# EAGLE design untitled (EAGLE 6.5.0)
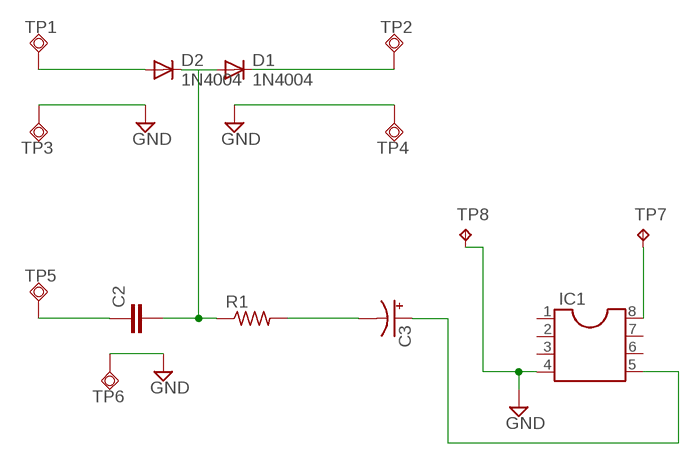
[diagram p0: schematic, sheet 1]

## Parts
C2  C5/3  [C5B3]
C3  CPOL-USE5-6  [E5-6]
D1  1N4004  [DO41-10]
D2  1N4004  [DO41-10]
IC1  DIL8S  [SOCKET-08]
R1  R-US_0204/7  [0204/7]
TP1  TPSQPAD1-20Y  [P1-20Y]
TP2  TPSQPAD1-20Y  [P1-20Y]
TP3  TPSQPAD1-20Y  [P1-20Y]
TP4  TPSQPAD1-20Y  [P1-20Y]
TP5  TPSQPAD1-20Y  [P1-20Y]
TP6  TPSQPAD1-20Y  [P1-20Y]
TP7  TPPAD1-20  [P1-20]
TP8  TPPAD1-20Y  [P1-20Y]

## Nets
GND: IC1.4 TP3.TP TP4.TP TP6.TP TP8.TP
N$1: C3.- R1.2
N$2: C2.2 D1.A D2.C R1.1
N$3: C3.+ IC1.5
N$4: C2.1 TP5.TP
N$5: IC1.8 TP7.TP
N$8: D2.A TP1.TP
N$9: D1.C TP2.TP
Unconnected: IC1.1 IC1.2 IC1.3 IC1.6 IC1.7

## Library data of the parts
C2 = capacitor-wima:C: CAPACITOR naming: grid - package width
C3 = rcl:CPOL-US: POLARIZED CAPACITOR, American symbol
D1 = diode:1N4004: DIODE
D2 = adafruit:1N4004: DIODE
IC1 = ic-package:DIL8: Dual In Line / Socket
R1 = rcl:R-US_: RESISTOR, American symbol
TP1-TP6 = testpad:TPSQ: Test pad
TP7 TP8 = testpad:TP: Test pad

## Board
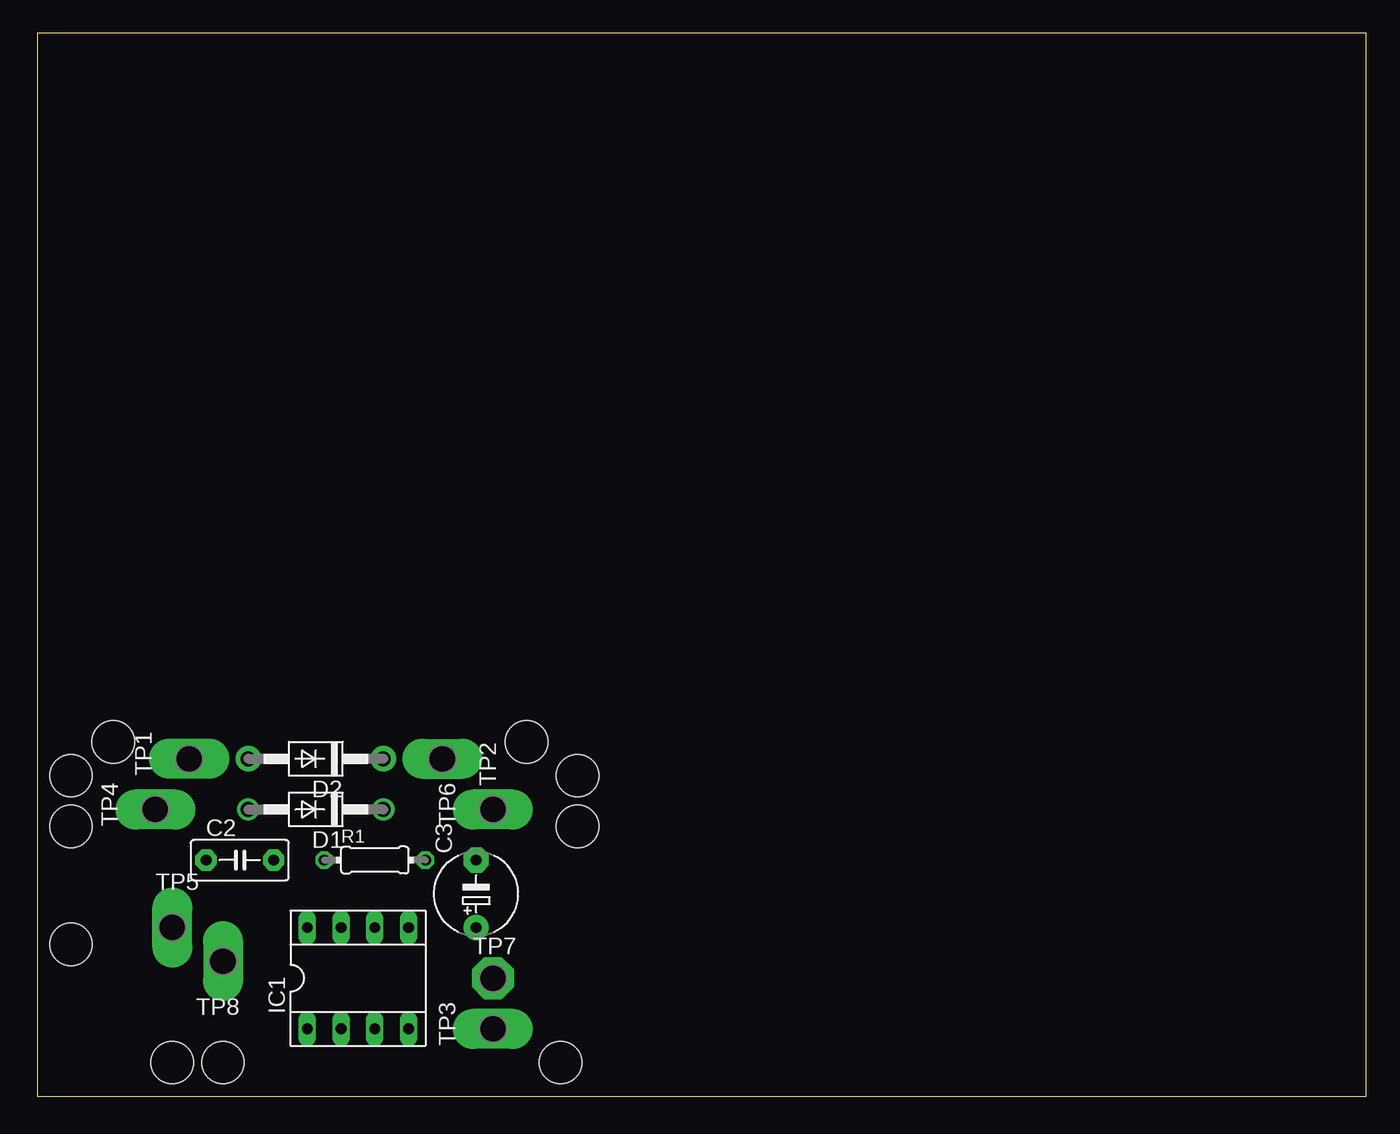
[diagram p1: board, top side]
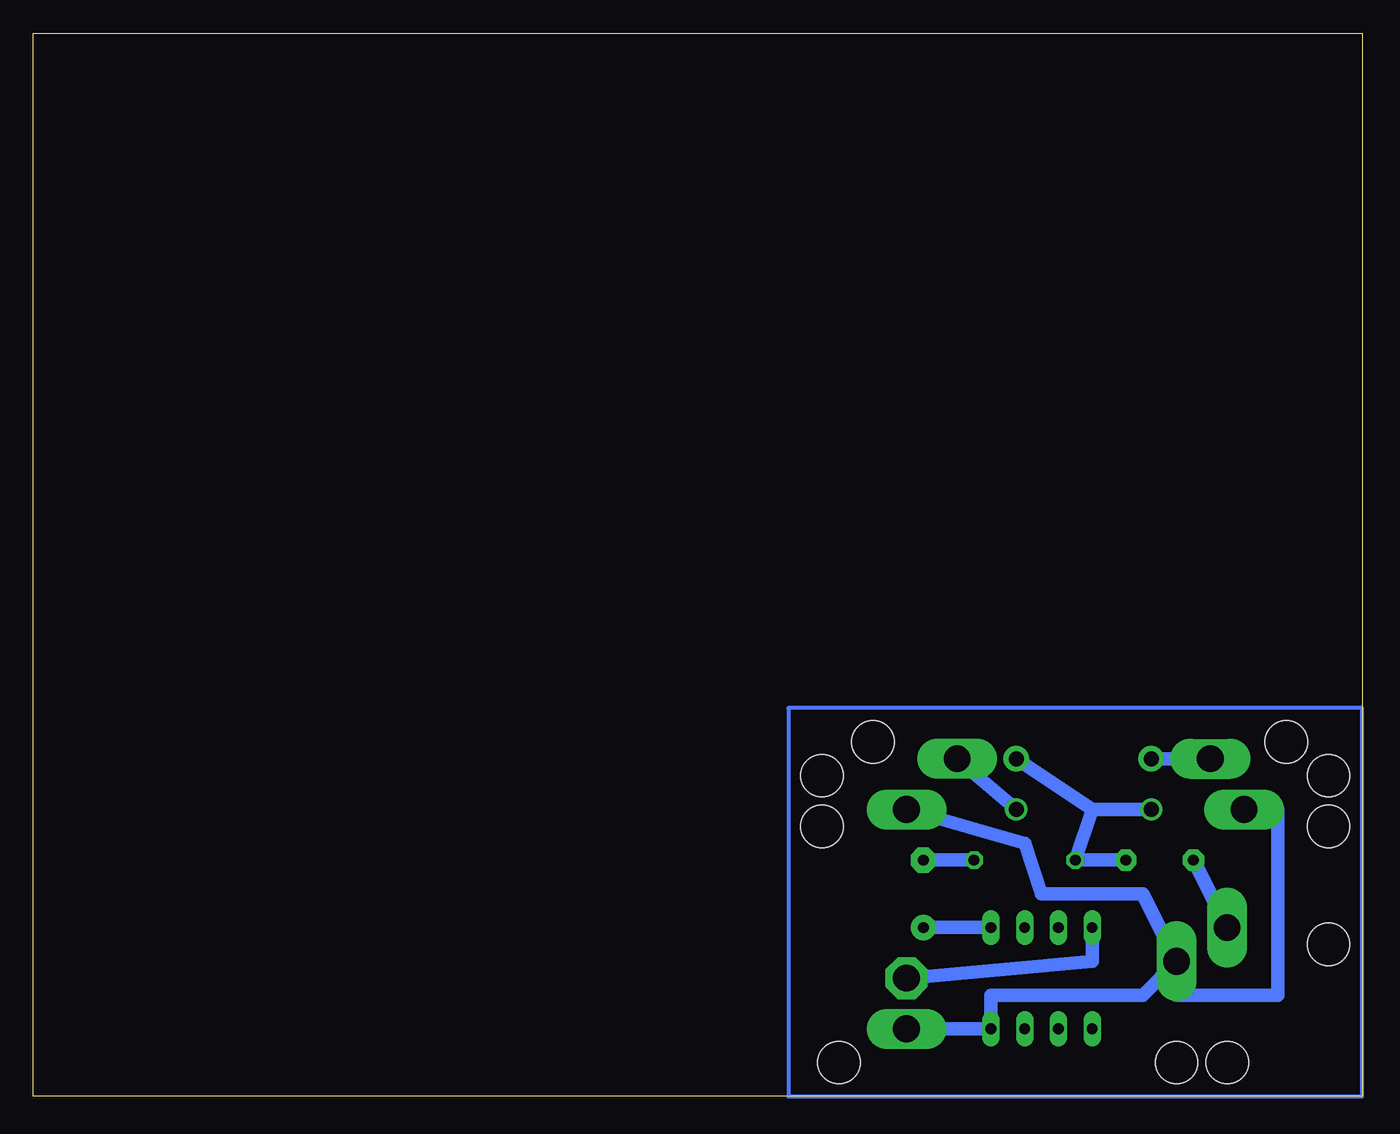
[diagram p2: board, bottom side, seen from below]

Size 100 x 80 mm. Coordinates in mm from the lower left corner, seen from the top.
Outline: 0,0 100,0 100,80 0,80 0,0
Copper layers (1*16): Top 0.035mm / dielectric 1.5mm / Bottom 0.035mm
Design rules "default": minimum track width 10mil, minimum drill 24mil, track to track 8mil, track to pad 8mil, pad to pad 8mil, via to via 8mil, smd to smd 8mil, copper to edge 40mil, drill to drill 8mil, minimum pad ring 10mil, minimum via ring 8mil, stop-mask expansion 4mil, vias tented up to drill 0mil, thermal gap 10mil
Holes 3.2 mm at 13.97,2.54 10.16,2.54 2.54,24.13 2.54,20.32 36.83,26.67 40.64,24.13 2.54,11.43 40.64,20.32 39.37,2.54 5.71,26.67

### Footprints (pad centres in the part's own frame; a part is rotated, then mirrored left to right if it is on the bottom)
C5B3 = drill 0.813 pad 1.6 octagon: 1 -2.54,0; 2 2.54,0
E5-6 = drill 0.813 pad 1.905: + -2.54,0 | drill 0.813 pad 1.905 octagon: - 2.54,0
DO41-10 = drill 1.118: A 5.08,0; C -5.08,0
DO41-10' = drill 1.118 pad 1.93: A 5.08,0; C -5.08,0
SOCKET-08 = drill 0.813 long: 1 -3.81,-3.81; 2 -1.27,-3.81; 3 1.27,-3.81; 4 3.81,-3.81; 5 3.81,3.81; 6 1.27,3.81; 7 -1.27,3.81; 8 -3.81,3.81
0204/7 = drill 0.813 octagon: 1 -3.81,0; 2 3.81,0
P1-20Y = drill 2.007 pad 2.54 long: TP 0,0
P1-20 = drill 2.007 pad 3.15 octagon: TP 0,0

### Placement (x,y rotation side)
C2  15.24,17.78 0 top
C3  33.02,15.24 90 top
D1  20.95,21.59 180 top
D2  1N4004  [DO41-10']  20.95,25.4 180 top
IC1  24.13,8.89 0 top
R1  25.4,17.78 0 top
TP1  11.43,25.4 90 top
TP2  30.48,25.4 270 top
TP3  34.29,5.08 90 top
TP4  8.89,21.59 90 top
TP5  10.16,12.7 0 top
TP6  34.29,21.59 90 top
TP7  34.29,8.89 0 top
TP8  13.97,10.16 180 top

### Tracks (layer width: path | path; a pad name or v marks a point on that pad's centre or on a via)
GND
  Bottom 1.016: TP8.TP 16.51,7.62 27.94,7.62 IC1.4 TP3.TP | TP8.TP 16.51,15.24 24.13,15.24 25.4,19.05 TP6.TP | TP4.TP 6.35,21.59 6.35,7.62 13.97,7.62 TP8.TP
N$1
  Bottom 1.016: C3.- R1.2
N$2
  Bottom 1.016: C2.2 R1.1 20.32,21.59 | D1.A 20.32,21.59 | 20.32,21.59 D2.C
N$3
  Bottom 1.016: IC1.5 C3.+
N$4
  Bottom 1.016: C2.1 TP5.TP
N$5
  Bottom 1.016: TP7.TP 20.32,10.16 IC1.8
N$6
  Bottom 0.305: 0,0 0,29.21 43.18,29.21 43.18,0 0,0
N$8
  Bottom 1.016: D2.A TP1.TP
N$9
  Bottom 1.016: TP2.TP D1.C